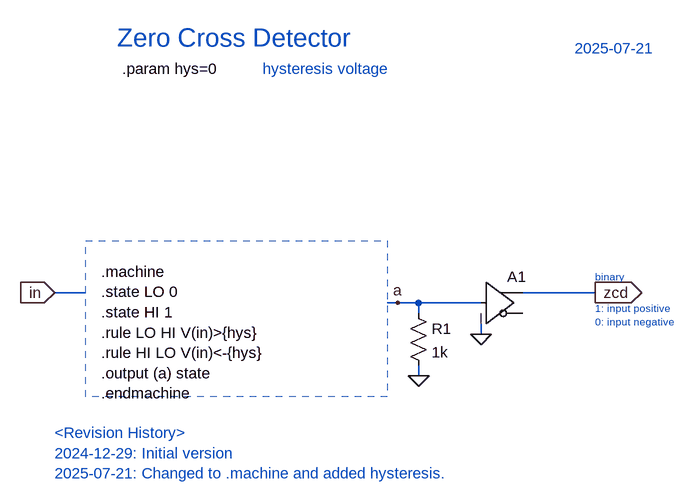
[diagram p0: schematic ZCD.asc]
ZCD.asc, the LTspice schematic file:
Version 4.1
SHEET 1 952 680
WIRE -32 384 -80 384
WIRE 752 384 640 384
WIRE 448 400 432 400
WIRE 480 400 448 400
WIRE 576 400 480 400
WIRE 480 416 480 400
WIRE 576 448 576 432
WIRE 480 512 480 496
FLAG -80 384 in
IOPIN -80 384 In
FLAG 752 384 zcd
IOPIN 752 384 Out
FLAG 480 512 0
FLAG 448 400 a
FLAG 576 448 0
SYMBOL res 464 400 R0
SYMATTR InstName R1
SYMATTR Value 1k
SYMBOL Digital\\buf 576 336 R0
SYMATTR InstName A1
TEXT 16 -8 Left 4 ;Zero Cross Detector
TEXT 752 360 Left 1 ;binary
TEXT 752 408 Left 1 ;1: input positive\n0: input negative
TEXT 720 8 Left 2 ;2025-07-21
TEXT -8 352 Left 2 !.machine\n.state LO 0\n.state HI 1\n.rule LO HI V(in)>{hys}\n.rule HI LO V(in)<-{hys}\n.output (a) state\n.endmachine
TEXT 24 40 Left 2 !.param hys=0
TEXT 240 40 Left 2 ;hysteresis voltage
TEXT -80 600 Left 2 ;<Revision History>\n2024-12-29: Initial version\n2025-07-21: Changed to .machine and added hysteresis.
RECTANGLE Normal 432 544 -32 304 2

The netlist it stands for:
* ZCD.asc
R1 a 0 1k
A1 a 0 0 0 0 0 zcd 0 BUF
* Zero Cross Detector
* binary
* 1: input positive
* 0: input negative
* 2025-07-21
.machine
.state LO 0
.state HI 1
.rule LO HI V(in)>{hys}
.rule HI LO V(in)<-{hys}
.output (a) state
.endmachine
.param hys=0
* hysteresis voltage
* <Revision History>
* 2024-12-29: Initial version
* 2025-07-21: Changed to .machine and added hysteresis.
.backanno
.end